# EAGLE schematic pic_tftp100_v2 (EAGLE 7.5.0)
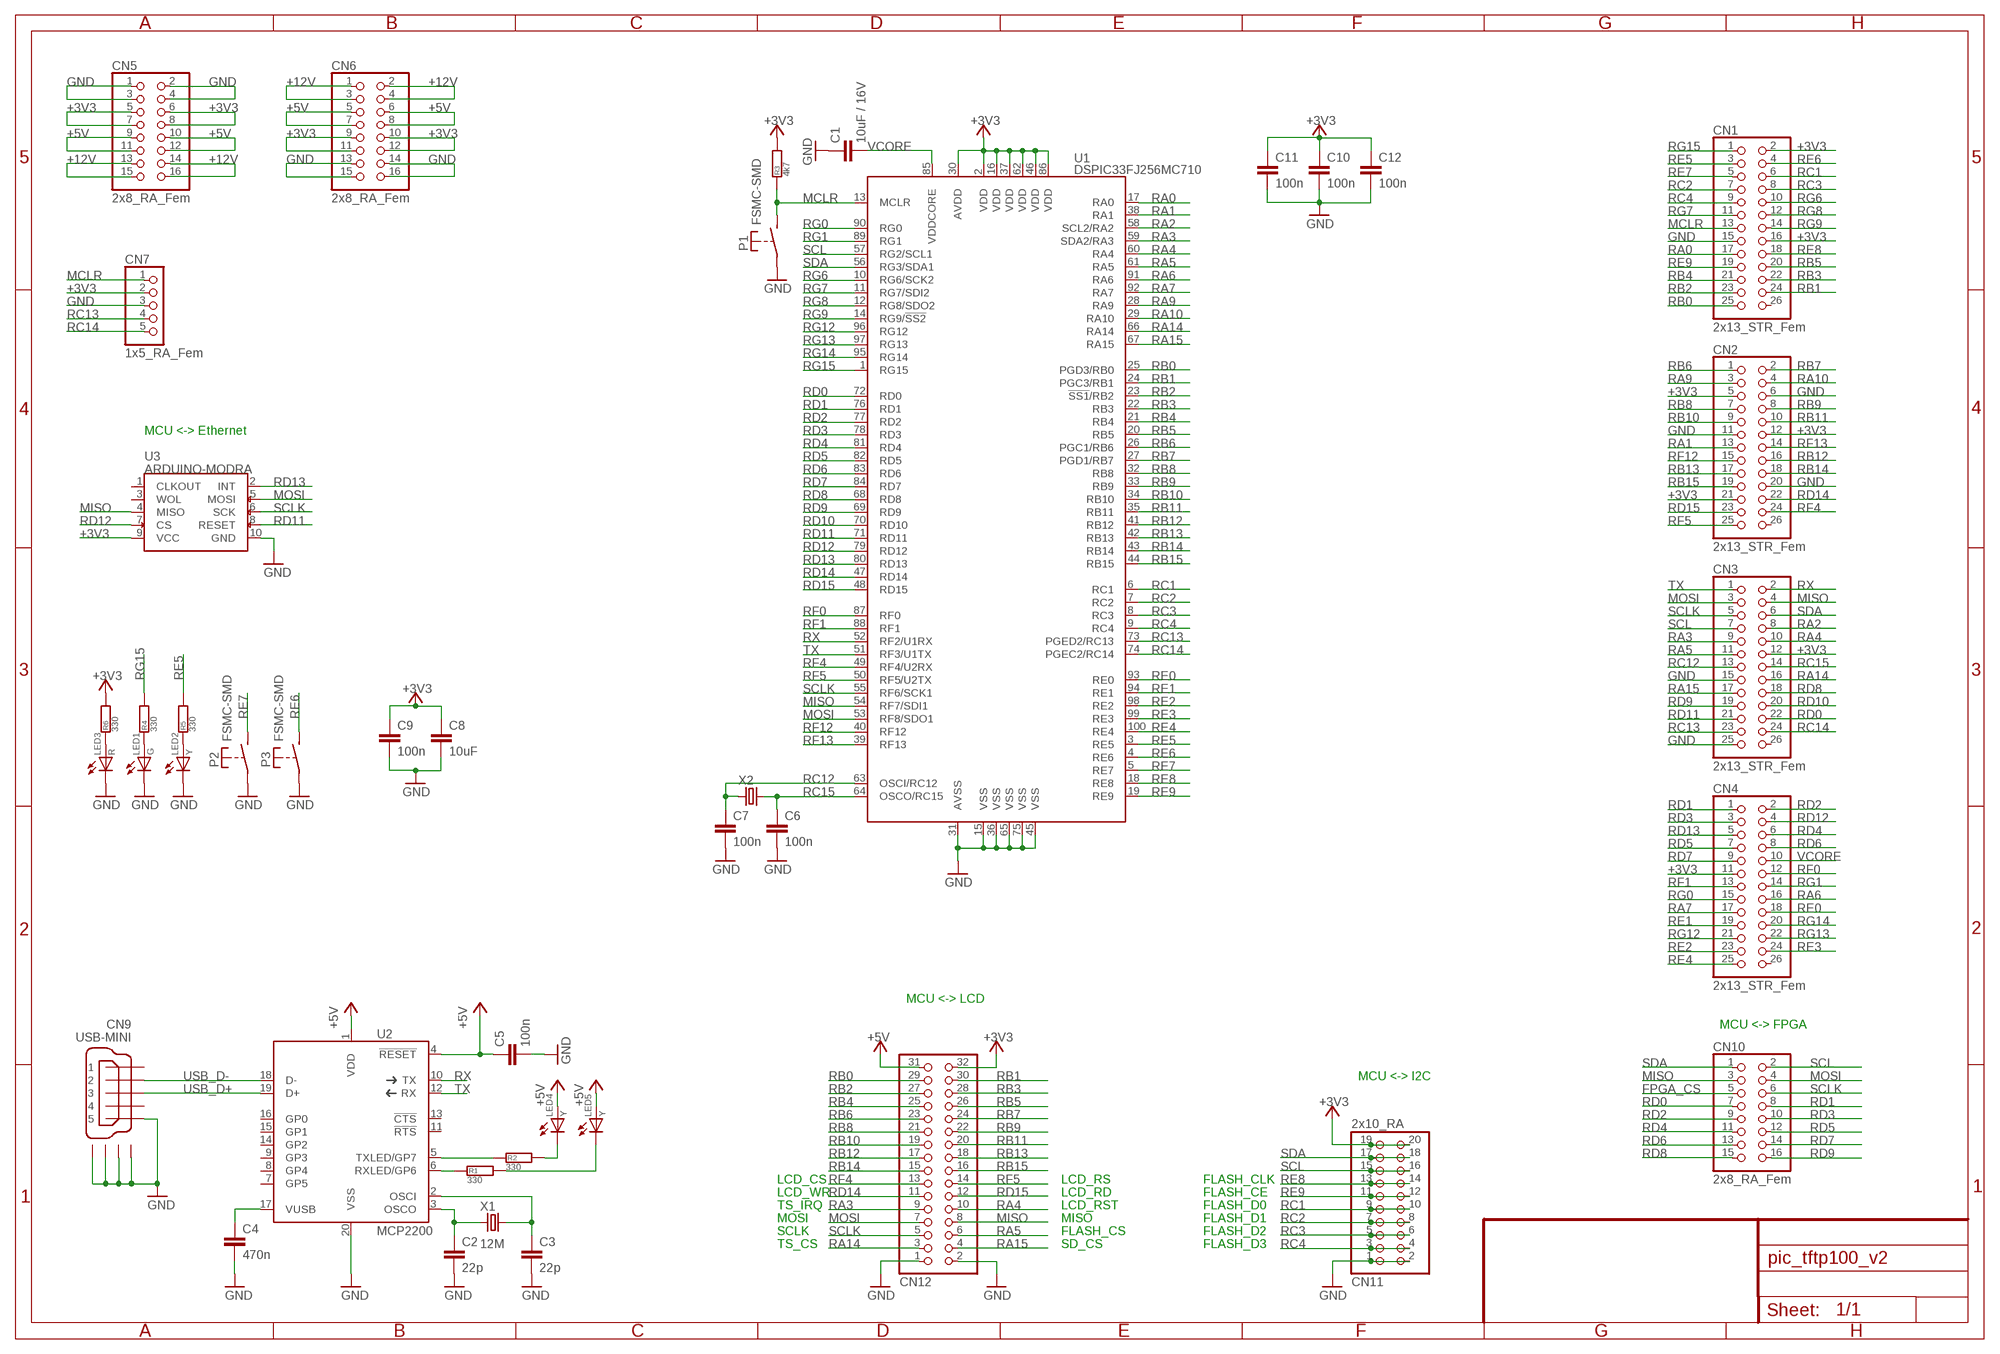
[diagram p0: schematic, sheet 1]

## Parts
C1  10uF / 16V  CONDENSATEURSC1206  [C1206]
C2  22p  CONDENSATEURSC1206  [C1206]
C3  22p  CONDENSATEURSC1206  [C1206]
C4  470n  CONDENSATEURSC1206  [C1206]
C5  100n  CONDENSATEURSC1206  [C1206]
C6  100n  CONDENSATEURSC1206  [C1206]
C7  100n  CONDENSATEURSC1206  [C1206]
C8  10uF  CAPAC1206  [C1206]
C9  100n  CONDENSATEURSC1206  [C1206]
C10  100n  CONDENSATEURSC1206  [C1206]
C11  100n  CONDENSATEURSC1206  [C1206]
C12  100n  CONDENSATEURSC1206  [C1206]
CN1  2x13_STR_Fem  PINHD-2X13_2.54  [2X13]
CN2  2x13_STR_Fem  PINHD-2X13_2.54  [2X13]
CN3  2x13_STR_Fem  PINHD-2X13_2.54  [2X13]
CN4  2x13_STR_Fem  PINHD-2X13_2.54  [2X13]
CN5  2x8_RA_Fem  PINHD-2X8_2.54-90°  [2X08/90]
CN6  2x8_RA_Fem  PINHD-2X8_2.54-90°  [2X08/90]
CN7  1x5_RA_Fem  PINHD-1X5_2.54-90°  [1X05/90]
CN9  USB-MINI  [USB-MINI-SMT]
CN10  2x8_RA_Fem  PINHD-2X8_2.54-90°  [2X08/90]
CN11  2x10_RA  PINHD-2X10_2.54-90°  [2X10/90]
CN12  PINHD-2X16_2.54-90°  [2X16/90]
LED1  G  LED3MM  [LED3MM]
LED2  Y  LED3MM  [LED3MM]
LED3  R  LED3MM  [LED3MM]
LED4  Y  LED3MM  [LED3MM]
LED5  Y  LED3MM  [LED3MM]
P1  FSMC-SMD  [FSMC-SMD]
P2  FSMC-SMD  [FSMC-SMD]
P3  FSMC-SMD  [FSMC-SMD]
R1  330  RESISTANCESR1206  [R1206]
R2  330  RESISTANCESR1206  [R1206]
R3  4k7  RESISTANCESR1206  [R1206]
R4  330  RESISTANCESR1206  [R1206]
R5  330  RESISTANCESR1206  [R1206]
R6  330  RESISTANCESR1206  [R1206]
U1  DSPIC33FJ256MC710  [TQFP100]
U2  MCP2200  [SOIC20L]
U3  ARDUINO-MODRA  [ARDUINO_MOD_RIGHT_ANGLE]
X1  12M  CRYSTALSMD2_50X32  [SMD2_50X32]
X2  CRYSTALSMD2_50X32  [SMD2_50X32]

## Nets
+3V3: C8.1 C9.1 C10.1 C11.1 C12.1 CN1.2 CN1.16 CN2.5 CN2.12 CN2.21 CN3.12 CN4.11 CN5.5 CN5.6 CN5.7 CN5.8 CN6.9 CN6.10 CN6.11 CN6.12 CN7.2 CN11.19 CN11.20 CN12.32 R3.2 R6.2 U1.2(VDD) U1.16(VDD) U1.30(AVDD) U1.37(VDD) U1.46(VDD) U1.62(VDD) U1.86(VDD) U3.9(VCC)
+5V: C5.1 CN5.9 CN5.10 CN5.11 CN5.12 CN6.5 CN6.6 CN6.7 CN6.8 CN12.31 LED4.A LED5.A U2.1(VDD) U2.4(!RESET)
+12V: CN5.13 CN5.14 CN5.15 CN5.16 CN6.1 CN6.2 CN6.3 CN6.4
FPGA_CS: CN10.5
GND: C1.1 C2.2 C3.2 C4.2 C5.2 C6.2 C7.2 C8.2 C9.2 C10.2 C11.2 C12.2 CN1.15 CN2.6 CN2.11 CN2.20 CN3.15 CN3.25 CN5.1 CN5.2 CN5.3 CN5.4 CN6.13 CN6.14 CN6.15 CN6.16 CN7.3 CN9.5 CN9.M1 CN9.M2 CN9.M3 CN9.M4 CN11.1 CN11.2 CN12.1 CN12.2 LED1.K(C) LED2.K(C) LED3.K(C) P1.P$1(P) P2.P$1(P) P3.P$1(P) U1.15(VSS) U1.31(AVSS) U1.36(VSS) U1.45(VSS) U1.65(VSS) U1.75(VSS) U2.20(VSS) U3.10(GND)
MCLR: CN1.13 CN7.1 P1.P$2(S) R3.1 U1.13(MCLR)
MISO: CN3.4 CN10.3 CN12.8 U1.54(RF7/SDI1) U3.4(MISO)
MOSI: CN3.3 CN10.4 CN12.7 U1.53(RF8/SDO1) U3.5(MOSI)
N$1: R1.1 U2.6(RXLED/GP6)
N$2: R2.1 U2.5(TXLED/GP7)
N$3: LED5.K(C) R1.2
N$4: LED4.K(C) R2.2
N$5: C2.1 U2.3(OSCO) X1.1
N$6: C3.1 U2.2(OSCI) X1.2
N$7: C4.1 U2.17(VUSB)
N$10: LED1.A R4.1
N$11: LED2.A R5.1
N$19: LED3.A R6.1
RA0: CN1.17 U1.17(RA0)
RA1: CN2.13 U1.38(RA1)
RA2: CN3.8 U1.58(SCL2/RA2)
RA3: CN3.9 CN12.9 U1.59(SDA2/RA3)
RA4: CN3.10 CN12.10 U1.60(RA4)
RA5: CN3.11 CN12.6 U1.61(RA5)
RA6: CN4.16 U1.91(RA6)
RA7: CN4.17 U1.92(RA7)
RA9: CN2.3 U1.28(RA9)
RA10: CN2.4 U1.29(RA10)
RA14: CN3.16 CN12.3 U1.66(RA14)
RA15: CN3.17 CN12.4 U1.67(RA15)
RB0: CN1.25 CN12.29 U1.25(PGD3/RB0)
RB1: CN1.24 CN12.30 U1.24(PGC3/RB1)
RB2: CN1.23 CN12.27 U1.23(!SS1!/RB2)
RB3: CN1.22 CN12.28 U1.22(RB3)
RB4: CN1.21 CN12.25 U1.21(RB4)
RB5: CN1.20 CN12.26 U1.20(RB5)
RB6: CN2.1 CN12.23 U1.26(PGC1/RB6)
RB7: CN2.2 CN12.24 U1.27(PGD1/RB7)
RB8: CN2.7 CN12.21 U1.32(RB8)
RB9: CN2.8 CN12.22 U1.33(RB9)
RB10: CN2.9 CN12.19 U1.34(RB10)
RB11: CN2.10 CN12.20 U1.35(RB11)
RB12: CN2.16 CN12.17 U1.41(RB12)
RB13: CN2.17 CN12.18 U1.42(RB13)
RB14: CN2.18 CN12.15 U1.43(RB14)
RB15: CN2.19 CN12.16 U1.44(RB15)
RC1: CN1.6 CN11.9 CN11.10 U1.6(RC1)
RC2: CN1.7 CN11.7 CN11.8 U1.7(RC2)
RC3: CN1.8 CN11.5 CN11.6 U1.8(RC3)
RC4: CN1.9 CN11.3 CN11.4 U1.9(RC4)
RC12: C7.1 CN3.13 U1.63(OSCI/RC12) X2.1
RC13: CN3.23 CN7.4 U1.73(PGED2/RC13)
RC14: CN3.24 CN7.5 U1.74(PGEC2/RC14)
RC15: C6.1 CN3.14 U1.64(OSCO/RC15) X2.2
RD0: CN3.22 CN10.7 U1.72(RD0)
RD1: CN4.1 CN10.8 U1.76(RD1)
RD2: CN4.2 CN10.9 U1.77(RD2)
RD3: CN4.3 CN10.10 U1.78(RD3)
RD4: CN4.6 CN10.11 U1.81(RD4)
RD5: CN4.7 CN10.12 U1.82(RD5)
RD6: CN4.8 CN10.13 U1.83(RD6)
RD7: CN4.9 CN10.14 U1.84(RD7)
RD8: CN3.18 CN10.15 U1.68(RD8)
RD9: CN3.19 CN10.16 U1.69(RD9)
RD10: CN3.20 U1.70(RD10)
RD11: CN3.21 U1.71(RD11) U3.8(RESET)
RD12: CN4.4 U1.79(RD12) U3.7(CS)
RD13: CN4.5 U1.80(RD13) U3.2(INT)
RD14: CN2.22 CN12.11 U1.47(RD14)
RD15: CN2.23 CN12.12 U1.48(RD15)
RE0: CN4.18 U1.93(RE0)
RE1: CN4.19 U1.94(RE1)
RE2: CN4.23 U1.98(RE2)
RE3: CN4.24 U1.99(RE3)
RE4: CN4.25 U1.100(RE4)
RE5: CN1.3 R5.2 U1.3(RE5)
RE6: CN1.4 P3.P$2(S) U1.4(RE6)
RE7: CN1.5 P2.P$2(S) U1.5(RE7)
RE8: CN1.18 CN11.13 CN11.14 U1.18(RE8)
RE9: CN1.19 CN11.11 CN11.12 U1.19(RE9)
RF0: CN4.12 U1.87(RF0)
RF1: CN4.13 U1.88(RF1)
RF4: CN2.24 CN12.13 U1.49(RF4/U2RX)
RF5: CN2.25 CN12.14 U1.50(RF5/U2TX)
RF12: CN2.15 U1.40(RF12)
RF13: CN2.14 U1.39(RF13)
RG0: CN4.15 U1.90(RG0)
RG1: CN4.14 U1.89(RG1)
RG6: CN1.10 U1.10(RG6/SCK2)
RG7: CN1.11 U1.11(RG7/SDI2)
RG8: CN1.12 U1.12(RG8/SDO2)
RG9: CN1.14 U1.14(RG9/!SS2)
RG12: CN4.21 U1.96(RG12)
RG13: CN4.22 U1.97(RG13)
RG14: CN4.20 U1.95(RG14)
RG15: CN1.1 R4.2 U1.1(RG15)
RX: CN3.2 U1.52(RF2/U1RX) U2.10(TX)
SCL: CN3.7 CN10.2 CN11.15 CN11.16 U1.57(RG2/SCL1)
SCLK: CN3.5 CN10.6 CN12.5 U1.55(RF6/SCK1) U3.6(SCK)
SDA: CN3.6 CN10.1 CN11.17 CN11.18 U1.56(RG3/SDA1)
TX: CN3.1 U1.51(RF3/U1TX) U2.12(RX)
USB_D+: CN9.3 U2.19(D+)
USB_D-: CN9.2 U2.18(D-)
VCORE: C1.2 CN4.10 U1.85(VDDCORE)
Unconnected: CN1.26 CN2.26 CN3.26 CN4.26 CN9.1 CN9.4 U2.7(GP5) U2.8(GP4) U2.9(GP3) U2.11(!RTS) U2.13(!CTS) U2.14(GP2) U2.15(GP1) U2.16(GP0) U3.1(CLKOUT) U3.3(WOL)

## Notes on the sheet
- MCU <-> Ethernet
- MCU <-> LCD
- MCU <-> FPGA
- MCU <-> I2C
- LCD_CS | LCD_RS | FLASH_CLK
- LCD_WR | LCD_RD | FLASH_CE
- TS_IRQ | LCD_RST | FLASH_D0
- MOSI | MISO | FLASH_D1
- SCLK | FLASH_CS | FLASH_D2
- TS_CS | SD_CS | FLASH_D3

## Library data of the parts
C1-C7 C9-C12 = RLC:CONDENSATEURS: CAPACITOR, European symbol
C8 = Capacitors:CAPA: CAPACITOR, European symbol
CN1-CN4 = Con Pinhead:PINHD-2X13: PIN HEADER
CN5 CN6 CN10 = Con Pinhead:PINHD-2X8: PIN HEADER
CN7 = Con Pinhead:PINHD-1X5: PIN HEADER
CN9 = Con USB:USB-MINI
CN11 = Con Pinhead:PINHD-2X10: PIN HEADER
CN12 = Con Pinhead:PINHD-2X16: PIN HEADER
LED1-LED5 = LED:LED: LED OSRAM: - CHIPLED LG R971, LG N971, LY N971, LG Q971, LY Q971, LO R971, LY R971 LH N974, LH R974 LS Q976, LO Q976, LY Q976 LO Q996 - Hyper CHIPLED LW Q18S LB Q993, LB Q99A, LB R99A - SideLED LS A670, LO A670, LY A670, LG A670, LP A670 LB A673, LV A673, LT A673, LW A673 LH A674 LY A675 LS A676, LA A676, LO A676, LY A676, LW A676 LS A679, LY A679, LG A679 - Hyper Micro SIDELED® LS Y876, LA Y876, LO Y876, LY Y876 LT Y87S - SmartLED LW L88C, LW L88S LB L89C, LB L89S, LG L890 LS L89K, LO L89K, LY L89K LS L896, LA L896, LO L896, LY L896 - TOPLED LS T670, LO T670, LY T670, LG T670, LP T670 LSG T670, LSP T670, LSY T670, LOP T670, LYG T670 LG T671, LOG T671, LSG T671 LB T673, LV T673, LT T673, LW T673 LH T674 LS T676, LA T676, LO T676, LY T676, LB T676, LH T676, LSB T676, LW T676 LB T67C, LV T67C, LT T67C, LS T67K, LO T67K, LY T67K, LW E67C LS E67B, LA E67B, LO E67B, LY E67B, LB E67C, LV E67C, LT E67C LW T67C LS T679, LY T679, LG T679 LS T770, LO T770, LY T770, LG T770, LP T770 LB T773, LV T773, LT T773, LW T773 LH T774 LS E675, LA E675, LY E675, LS T675 LS T776, LA T776, LO T776, LY T776, LB T776 LHGB T686 LT T68C, LB T68C - Hyper Mini TOPLED® LB M676 - Mini TOPLED Santana® LG M470 LS M47K, LO M47K, LY M47K Source: http://www.osram.convergy.de/
P1-P3 = Switch:FSMC-SMD: TYCO SWITCH
R1-R6 = RLC:RESISTANCES: RESISTOR, European symbol
U1 = Microchip 24-30-32-33:DSPIC33FJ256MC710
U2 = Microchip:MCP2200
U3 = Ethernet:ARDUINO-MOD
X1 X2 = Crystals_Oscillators:CRYSTAL: CRYSTAL